# EAGLE design DollyShield (EAGLE 5.10)
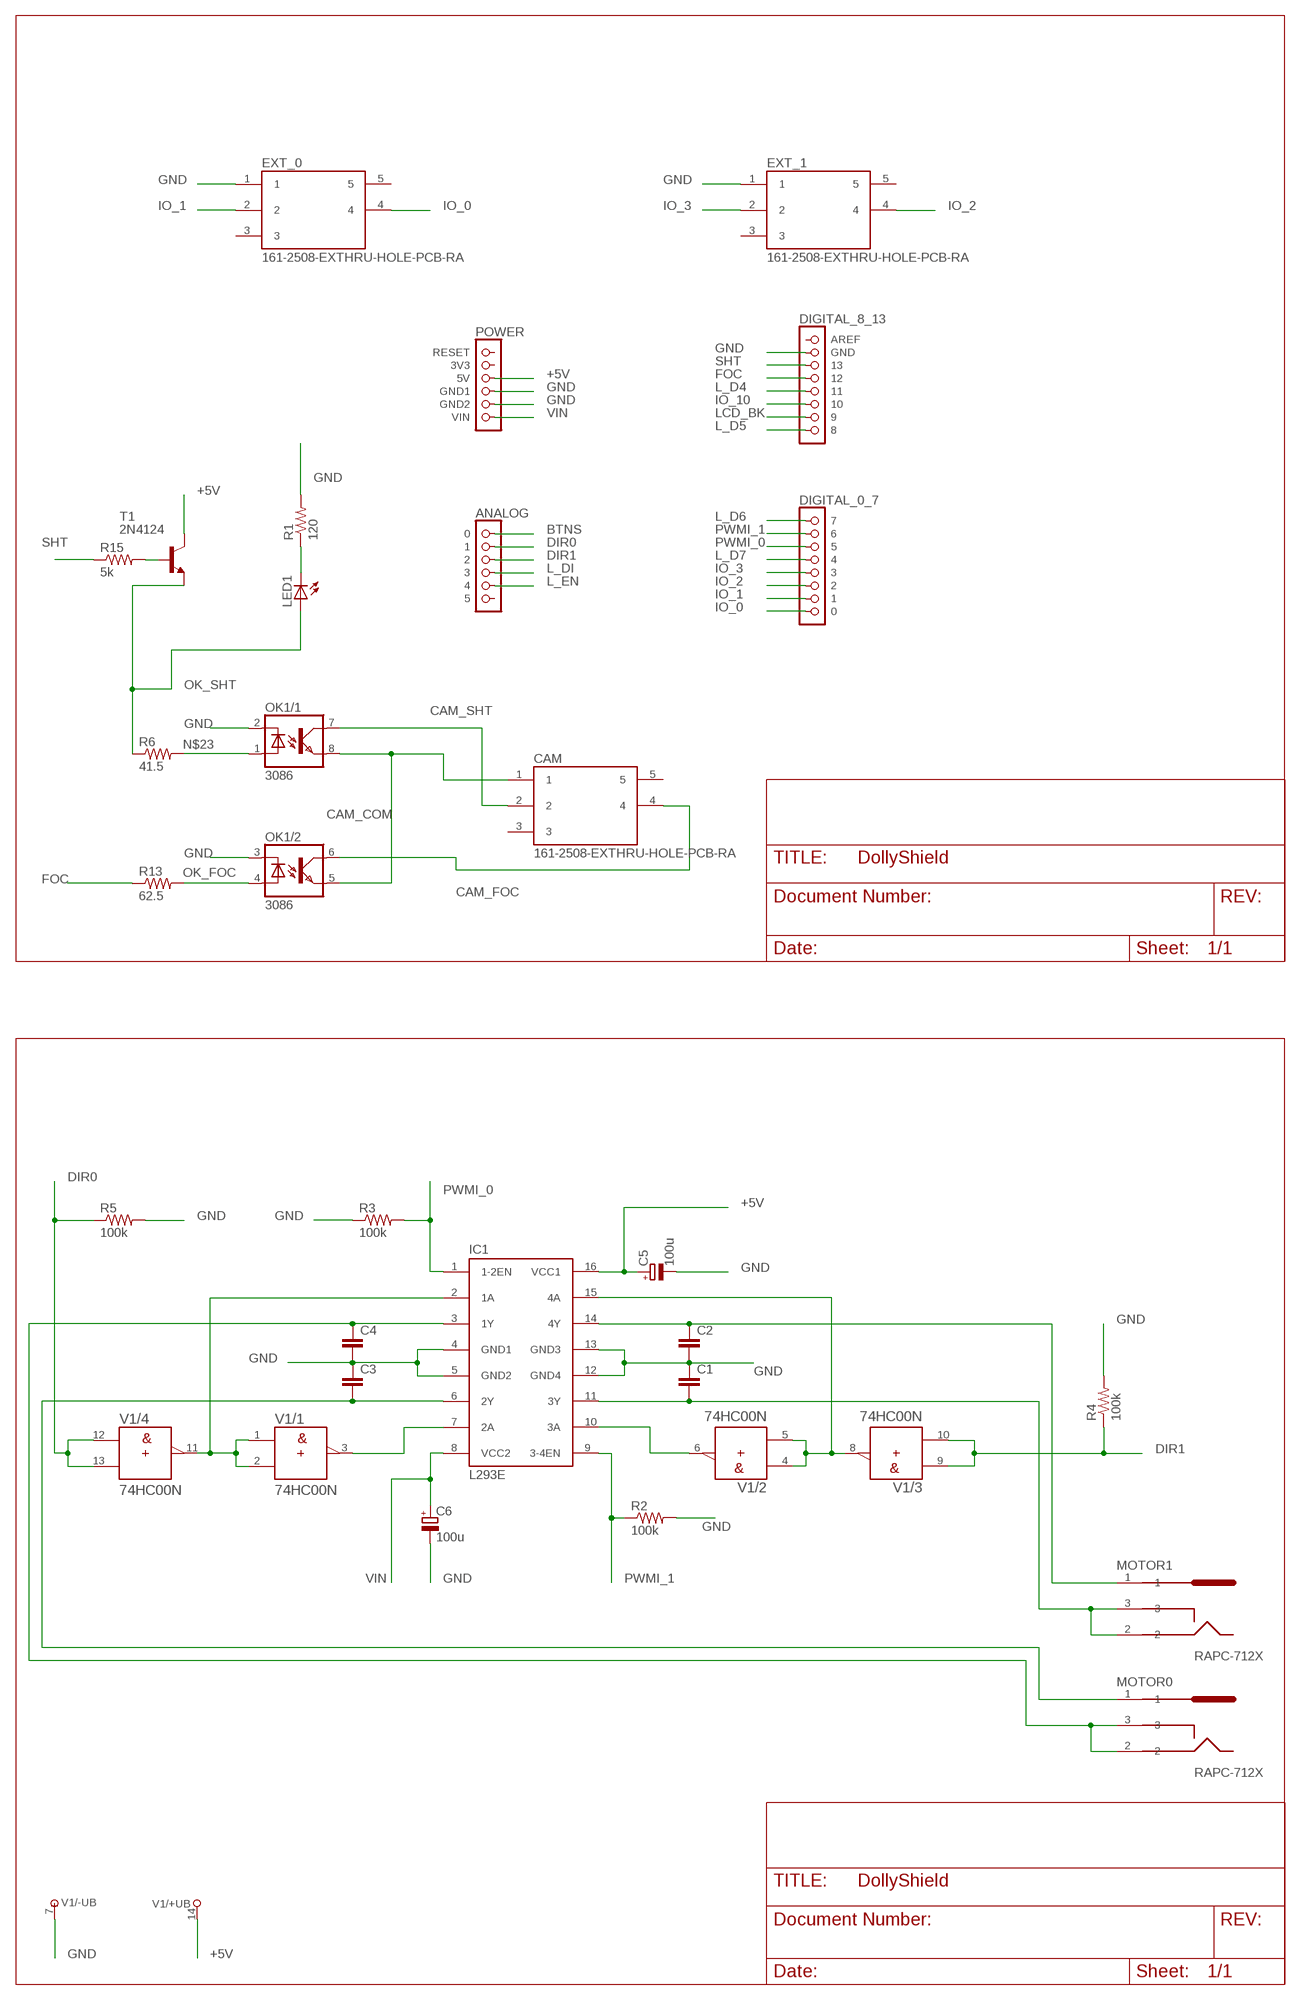
[diagram p0: schematic, sheet 1, part 1 of 2]
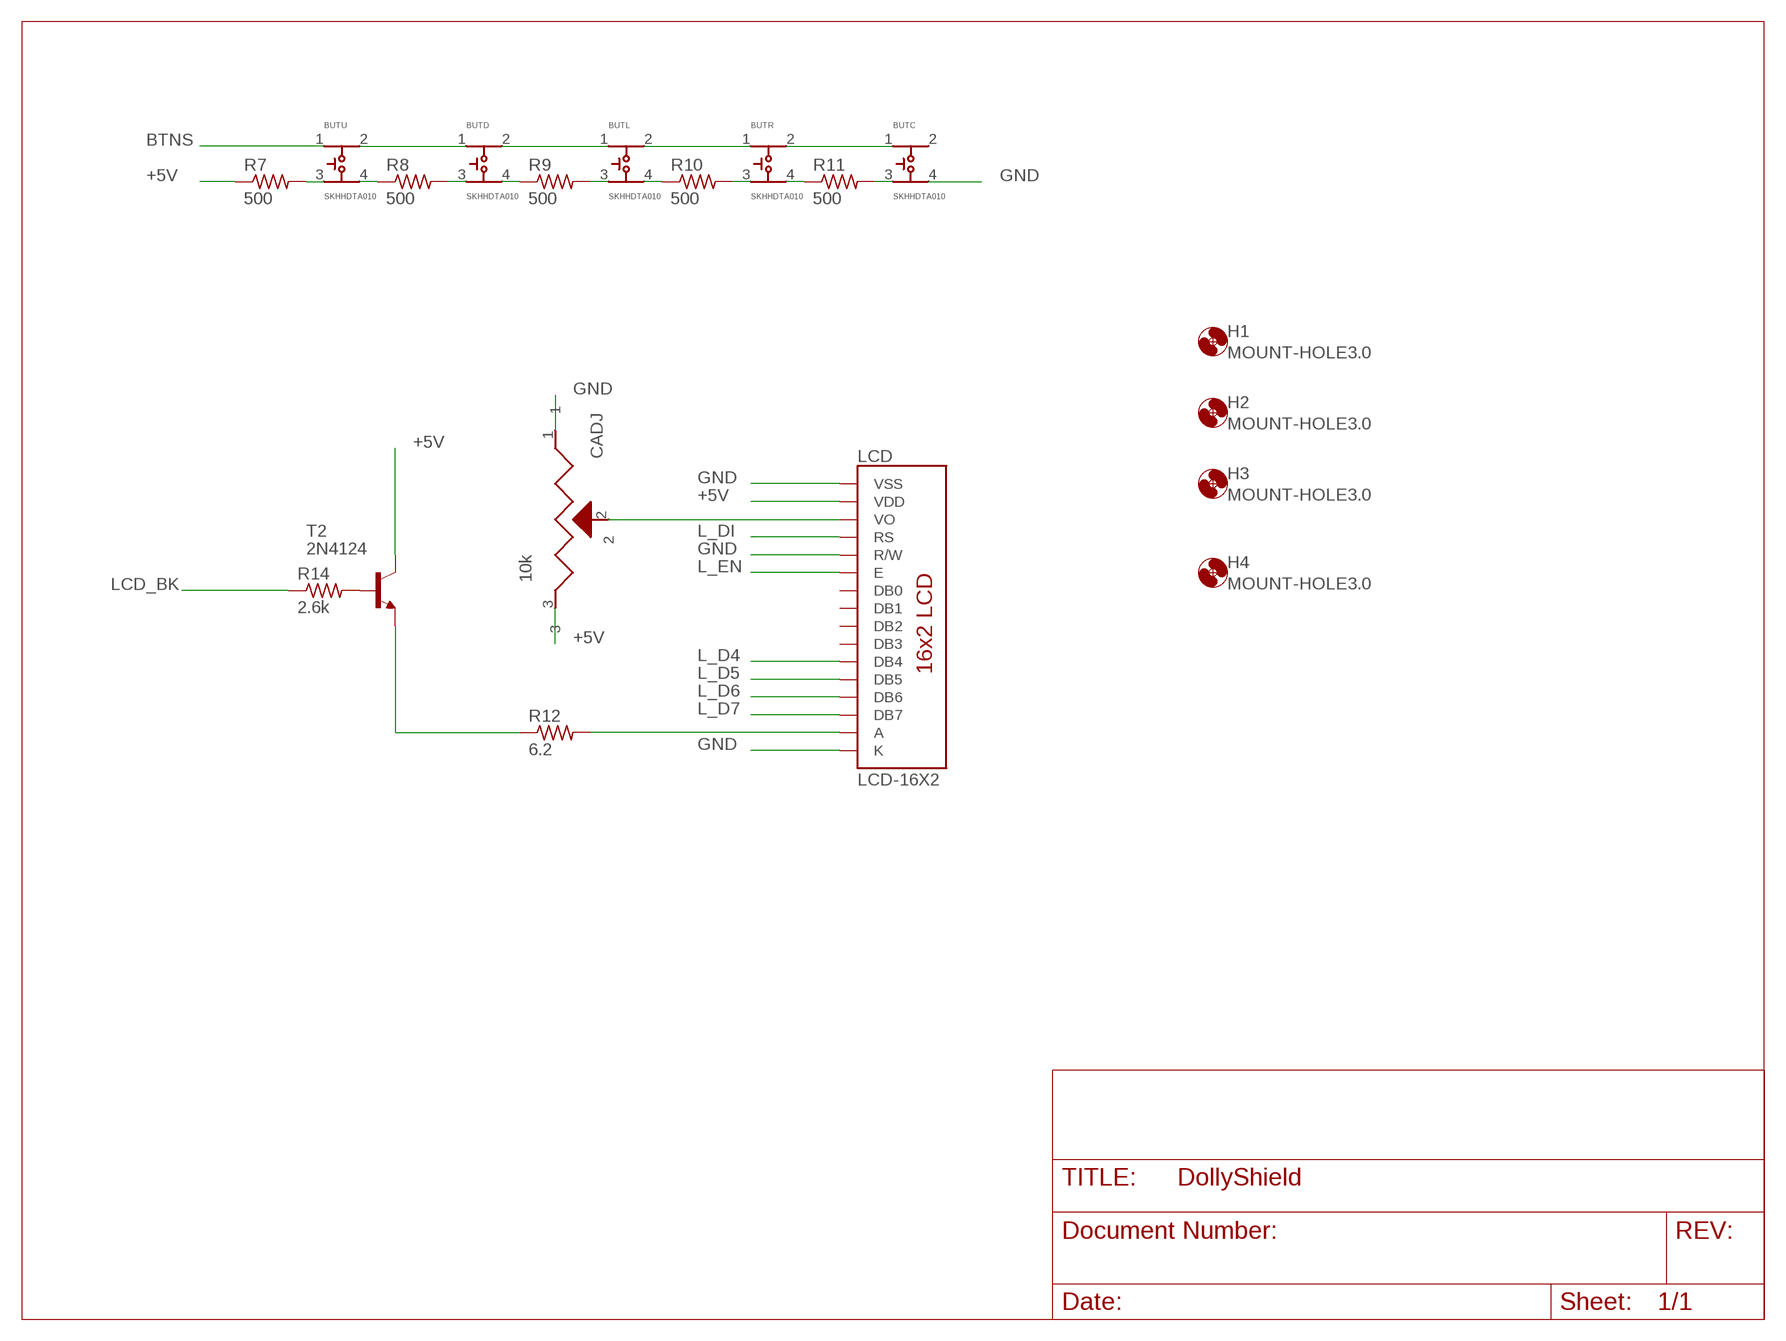
[diagram p1: schematic, sheet 1, part 2 of 2]

## Parts
BUTC  SKHHDTA010  SKHH  [SKHH]
BUTD  SKHHDTA010  SKHH  [SKHH]
BUTL  SKHHDTA010  SKHH  [SKHH]
BUTR  SKHHDTA010  SKHH  [SKHH]
BUTU  SKHHDTA010  SKHH  [SKHH]
C1  C5/3  [C5B3]
C2  C5/3  [C5B3]
C3  C5/3  [C5B3]
C4  C5/3  [C5B3]
C5  100u  CPOL-EUE2-5  [E2-5]
C6  100u  CPOL-EUE2-5  [E2-5]
CADJ  10k  3362U  [3362W]
CAM  161-2508-EXTHRU-HOLE-PCB-RA  [PCB-HORIZ]
EXT_0  161-2508-EXTHRU-HOLE-PCB-RA  [PCB-HORIZ]
EXT_1  161-2508-EXTHRU-HOLE-PCB-RA  [PCB-HORIZ]
H1  MOUNT-HOLE3.0  [3,0]
H2  MOUNT-HOLE3.0  [3,0]
H3  MOUNT-HOLE3.0  [3,0]
H4  MOUNT-HOLE3.0  [3,0]
IC1  L293E  [DIL16]
LCD  LCD-16X2  [LCD-16X2]
LED1  LED3MM  [LED3MM]
MOTOR0  RAPC-712X  [RAPC712X]
MOTOR1  RAPC-712X  [RAPC712X]
OK1  3086  [DIL08]
R1  120  R-US_0207/7  [0207/7]
R2  100k  R-US_0207/7  [0207/7]
R3  100k  R-US_0207/7  [0207/7]
R4  100k  R-US_0207/7  [0207/7]
R5  100k  R-US_0207/7  [0207/7]
R6  41.5  R-US_0207/7  [0207/7]
R7  500  R-US_0207/7  [0207/7]
R8  500  R-US_0207/7  [0207/7]
R9  500  R-US_0207/7  [0207/7]
R10  500  R-US_0207/7  [0207/7]
R11  500  R-US_0207/7  [0207/7]
R12  6.2  R-US_0207/7  [0207/7]
R13  62.5  R-US_0207/7  [0207/7]
R14  2.6k  R-US_0207/7  [0207/7]
R15  5k  R-US_0207/7  [0207/7]
T1  2N4124  -NPN-TO92-EBC  [TO92-EBC]
T2  2N4124  -NPN-TO92-EBC  [TO92-EBC]
U$1  POWER  [1X06]
U$2  ANALOG  [1X06]
U$3  DIGITAL_0_7  [1X08]
U$4  DIGITAL_8_13  [1X08]
V1  74HC00N  [DIL14]

## Nets
+5V: C5.+ CADJ.3 IC1.16(VCC1) LCD.2(VDD) R7.1 T1.C T2.C U$1.3(5V) V1.14(/+UB:+UB)
BTNS: BUTU.1 U$2.1
CAM_COM: CAM.1 OK1.5(/2:EMI) OK1.8(/1:EMI)
CAM_FOC: CAM.4 OK1.6(/2:COL)
CAM_SHT: CAM.2 OK1.7(/1:COL)
DIR0: R5.1 U$2.2 V1.12(/4:A) V1.13(/4:B)
DIR1: R4.1 U$2.3 V1.9(/3:A) V1.10(/3:B)
FOC: R13.1 U$4.4
GND: BUTC.4 C1.1 C2.2 C3.1 C4.2 C5.- C6.- CADJ.1 EXT_0.1 EXT_1.1 IC1.4(GND1) IC1.5(GND2) IC1.12(GND4) IC1.13(GND3) LCD.1(VSS) LCD.5(R/W) LCD.16(K) OK1.2(/1:C) OK1.3(/2:C) R1.2 R2.2 R3.1 R4.2 R5.2 U$1.4(GND1) U$1.5(GND2) U$4.2(GND) V1.7(/-UB:-UB)
IO_0: EXT_0.4 U$3.8
IO_1: EXT_0.2 U$3.7
IO_2: EXT_1.4 U$3.6
IO_3: EXT_1.2 U$3.5
IO_10: U$4.6
L_D4: LCD.11(DB4) U$4.5
L_D5: LCD.12(DB5) U$4.8
L_D6: LCD.13(DB6) U$3.1
L_D7: LCD.14(DB7) U$3.4
L_DI: LCD.4(RS) U$2.4
L_EN: LCD.6(E) U$2.5
LCD_BK: R14.1 U$4.7
LCDA: LCD.15(A) R12.2
M0_A: C3.2 IC1.6(2Y) MOTOR0.1
M0_B: C4.1 IC1.3(1Y) MOTOR0.2 MOTOR0.3
M1_A: C2.1 IC1.14(4Y) MOTOR1.1
M1_B: C1.2 IC1.11(3Y) MOTOR1.2 MOTOR1.3
N$1: LED1.K(C) R1.1
N$2: IC1.7(2A) V1.3(/1:Y)
N$3: IC1.2(1A) V1.1(/1:A) V1.2(/1:B) V1.11(/4:Y)
N$4: IC1.10(3A) V1.6(/2:Y)
N$5: IC1.15(4A) V1.4(/2:A) V1.5(/2:B) V1.8(/3:Y)
N$8: BUTU.3 R7.2
N$9: BUTU.4 R8.1
N$10: BUTD.3 R8.2
N$11: BUTD.4 R9.1
N$12: BUTL.3 R9.2
N$13: BUTL.4 R10.1
N$14: BUTR.3 R10.2
N$15: BUTR.4 R11.1
N$16: BUTC.3 R11.2
N$17: BUTD.1 BUTU.2
N$18: BUTD.2 BUTL.1
N$19: BUTL.2 BUTR.1
N$20: BUTC.1 BUTR.2
N$21: CADJ.2 LCD.3(VO)
N$23: OK1.1(/1:A) R6.2
N$24: R12.1 T2.E
N$25: R15.2 T1.B
N$26: R14.2 T2.B
OK_FOC: OK1.4(/2:A) R13.2
OK_SHT: LED1.A R6.1 T1.E
PWMI_0: IC1.1(1-2EN) R3.2 U$3.3
PWMI_1: IC1.9(3-4EN) R2.1 U$3.2
SHT: R15.1 U$4.3
VIN: C6.+ IC1.8(VCC2) U$1.6(VIN)
Unconnected: BUTC.2 CAM.3 CAM.5 EXT_0.3 EXT_0.5 EXT_1.3 EXT_1.5 LCD.7(DB0) LCD.8(DB1) LCD.9(DB2) LCD.10(DB3) U$1.1(RESET) U$1.2(3V3) U$2.6 U$4.1(AREF)

## Library data of the parts
BUTC BUTD BUTL BUTR BUTU = alps:SKHH: SKHH* vertical/joint stem momentary pushbutton PCB mount switch
C1-C4 = capacitor-wima:C: CAPACITOR naming: grid - package width
C5 C6 = rcl:CPOL-EU: POLARIZED CAPACITOR, European symbol
CADJ = bourns:3362U: Bourns 3362U trim pot top-adjust.
CAM EXT_0 EXT_1 = kobiconn-161-2508-ex:161-2508-EX
H1-H4 = holes:MOUNT-HOLE: MOUNTING HOLE with drill center marker
IC1 = texas:L293E: TI DEVICE
LCD = SparkFun:LCD-16X2
LED1 = SparkFun:LED: LEDs Standard schematic elements and footprints for 5mm, 3mm, 1206, and 0603 sized LEDs. 5mm - Spark Fun Electronics SKU : COM-00529 (and others)
MOTOR0 MOTOR1 = switchcraft:RAPC-712X
OK1 = cchurch-optocoupler:3086: NTE3086 Dual Opto-Coupler DIL8
R1-R15 = resistor:R-US_: RESISTOR, American symbol
T1 T2 = transistor-neu-to92:*-NPN-: NPN Transistror
U$1 = arduino:POWER
U$2 = arduino:ANALOG
U$3 = arduino:DIGITAL_0_7
U$4 = arduino:DIGITAL_8_13
V1 = 74ttl-din:74*00: Quad 2-input NAND gate

## Board
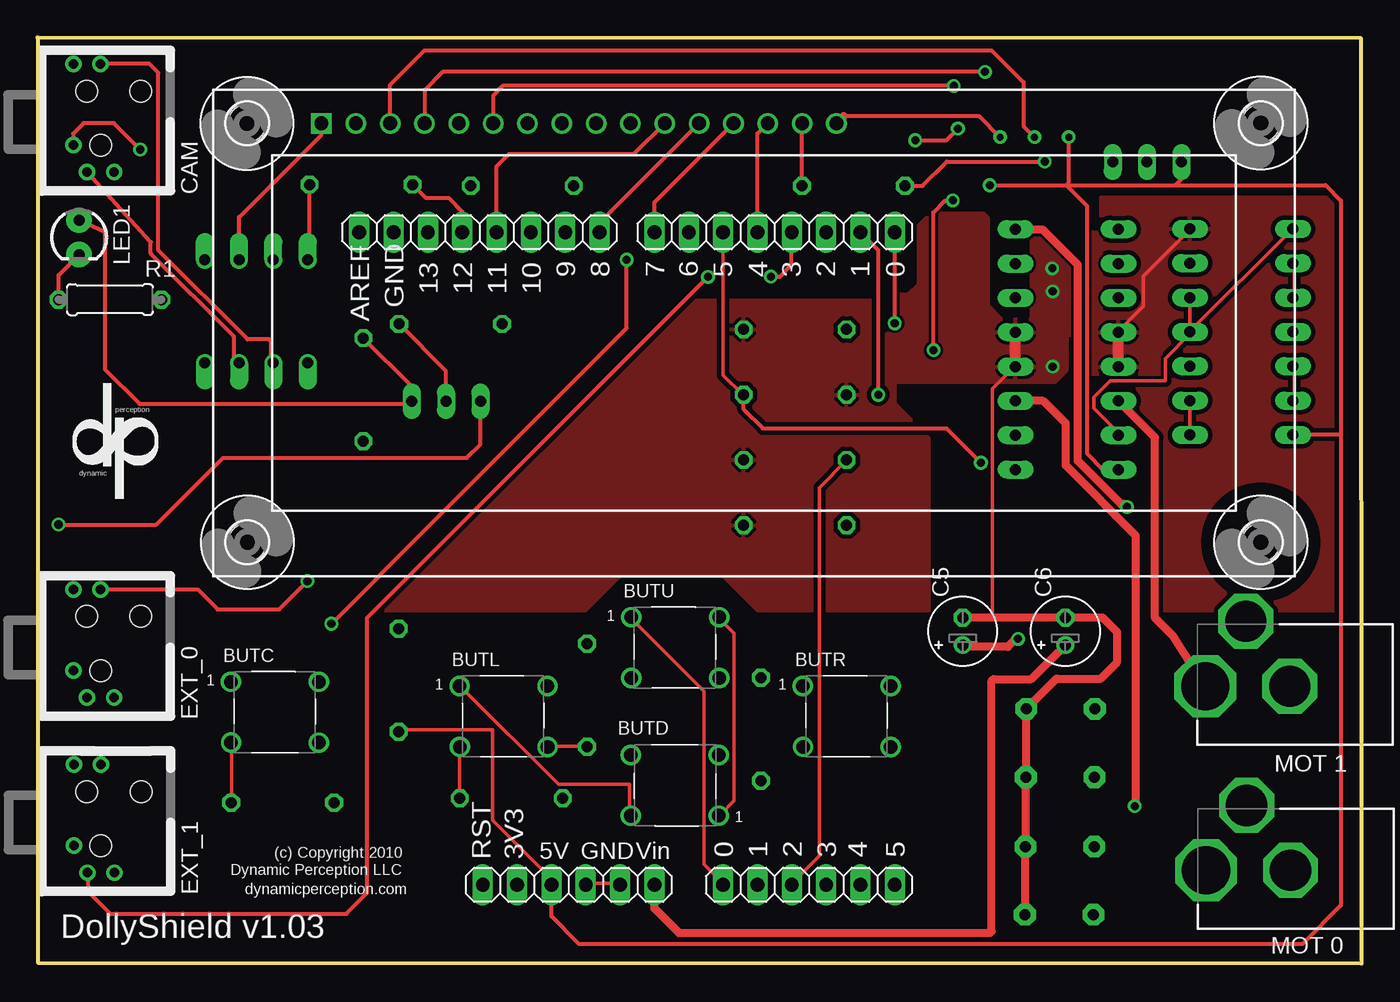
[diagram p2: board, top side]
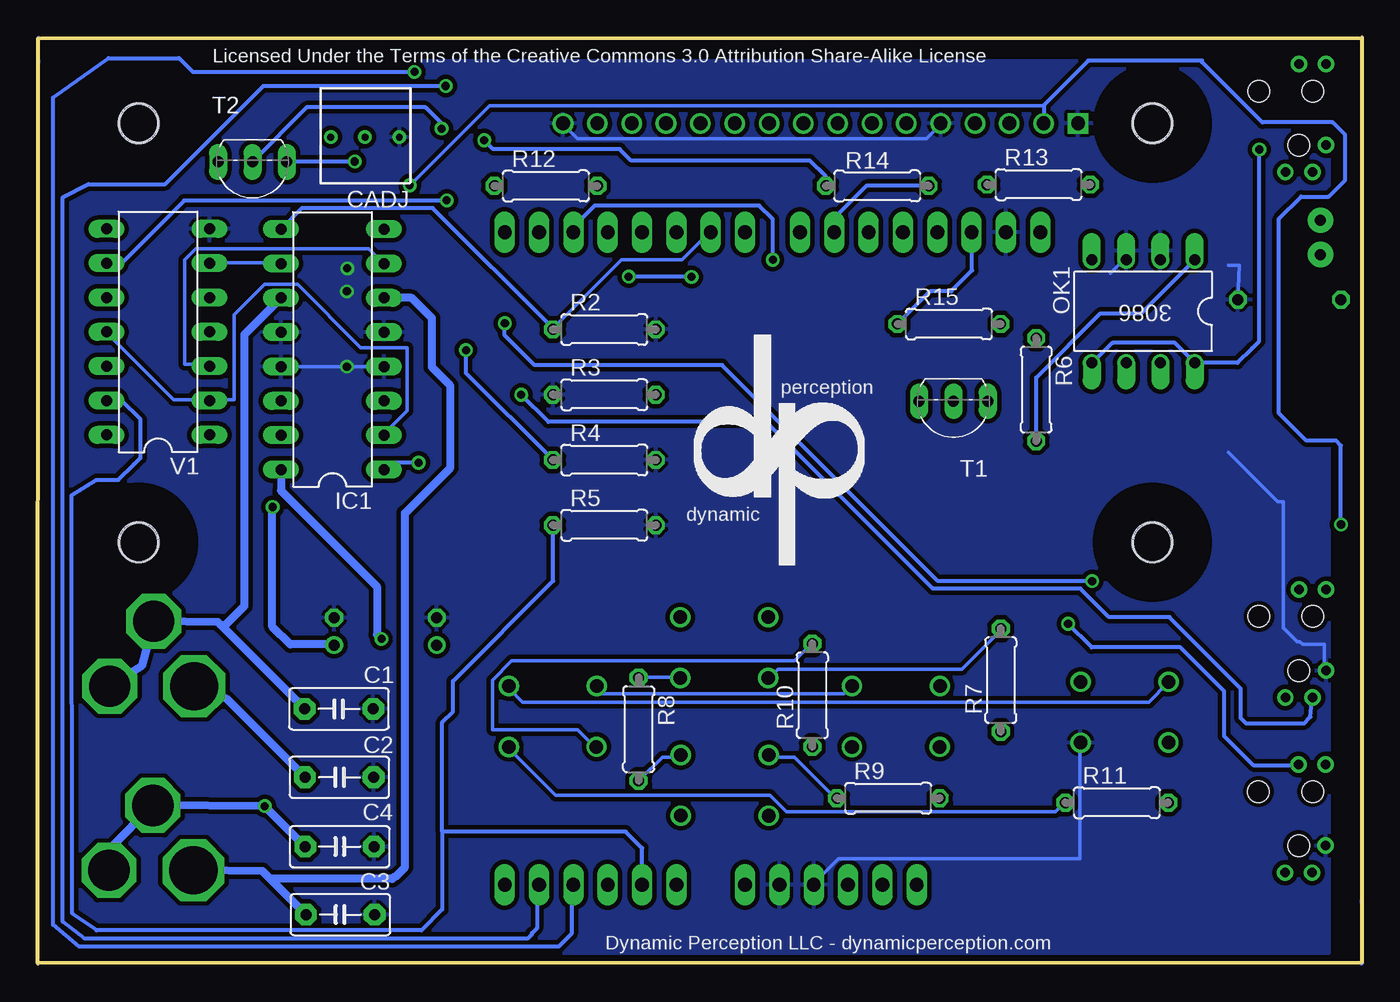
[diagram p3: board, bottom side, seen from below]

Size 98.04 x 68.48 mm. Coordinates in mm from the lower left corner, seen from the top.
Outline: 0,3.28 0,56.62
Outline: 0.08,68.48 0.1,0.05 98.04,0 98.02,68.43 0.08,68.48
Copper layers (1*16): Top 0.035mm / dielectric 1.5mm / Bottom 0.035mm
Design rules "default *": minimum track width 10mil, minimum drill 24mil, track to track 8mil, track to pad 8mil, pad to pad 8mil, via to via 8mil, smd to smd 8mil, copper to edge 8mil, drill to drill 8mil, minimum pad ring 10mil, minimum via ring 8mil, stop-mask expansion 4mil, vias tented up to drill 0mil, thermal gap 10mil

### Footprints (pad centres in the part's own frame; a part is rotated, then mirrored left to right if it is on the bottom)
SKHH = drill 1 round: 1 -3.242,2.261; 2 3.264,2.262; 3 -3.23,-2.242; 4 3.267,-2.245
C5B3 = drill 0.813 pad 1.6 octagon: 1 -2.54,0; 2 2.54,0
E2-5 = drill 0.813 pad 1.27 round: + -1.016,0 | drill 0.813 pad 1.27 octagon: - 1.016,0
3362W = drill 0.5 round: 1 -2.565,0.076; 2 -0.025,0.076; 3 2.515,0.076
PCB-HORIZ = drill 0.7 round: 1 -1.96,-0.32; 2 -3.96,-1.32; 3 -3.96,-3.33; 4 4.04,-2.32; 5 4.04,-0.32 | hole 1.6: 2.04,-1.29; 2.04,-5.29; -1.96,-2.32
3,0 = hole 3: 0,0
DIL16 = drill 0.813 long: 1 -8.89,-3.81; 2 -6.35,-3.81; 3 -3.81,-3.81; 4 -1.27,-3.81; 5 1.27,-3.81; 6 3.81,-3.81; 7 6.35,-3.81; 8 8.89,-3.81; 9 8.89,3.81; 10 6.35,3.81; 11 3.81,3.81; 12 1.27,3.81; 13 -1.27,3.81; 14 -3.81,3.81; 15 -6.35,3.81; 16 -8.89,3.81
LCD-16X2 = drill 1.016 square: 1 -32,15.5 | drill 1.016 round: 2 -29.46,15.5; 3 -26.92,15.5; 4 -24.38,15.5; 5 -21.84,15.5; 6 -19.3,15.5; 7 -16.76,15.5; 8 -14.22,15.5; 9 -11.68,15.5; 10 -9.14,15.5; 11 -6.6,15.5; 12 -4.06,15.5; 13 -1.52,15.5; 14 1.02,15.5; 15 3.56,15.5; 16 6.1,15.5 | hole 2.8: -37.5,15.5; -37.5,-15.5; 37.5,15.5; 37.5,-15.5
LED3MM = drill 0.813 pad 1.88 round: A -1.27,0; K 1.27,0
RAPC712X = drill 3.556 octagon: 1 0,-6.248 | drill 3.048 octagon: 2 0,0; 3 -4.801,-3.251
DIL08 = drill 0.813 offset: 1 -3.81,-3.81; 2 -1.27,-3.81; 3 1.27,-3.81; 4 3.81,-3.81; 5 3.81,3.81; 6 1.27,3.81; 7 -1.27,3.81; 8 -3.81,3.81
0207/7 = drill 0.813 octagon: 1 -3.81,0; 2 3.81,0
TO92-EBC = drill 0.813 long: B 0,-1.27; C 2.54,-1.27; E -2.54,-1.27
1X06 = drill 1.016 long: 1 -6.35,0; 2 -3.81,0; 3 -1.27,0; 4 1.27,0; 5 3.81,0; 6 6.35,0
1X08 = drill 1.016 long: 1 -8.89,0; 2 -6.35,0; 3 -3.81,0; 4 -1.27,0; 5 1.27,0; 6 3.81,0; 7 6.35,0; 8 8.89,0
DIL14 = drill 0.813 long: 1 -7.62,-3.81; 2 -5.08,-3.81; 3 -2.54,-3.81; 4 0,-3.81; 5 2.54,-3.81; 6 5.08,-3.81; 7 7.62,-3.81; 8 7.62,3.81; 9 5.08,3.81; 10 2.54,3.81; 11 0,3.81; 12 -2.54,3.81; 13 -5.08,3.81; 14 -7.62,3.81

### Placement (x,y rotation side)
BUTC  17.63,18.57 0 top
BUTD  47.24,13.18 180 top
BUTL  34.54,18.26 0 top
BUTR  59.94,18.26 0 top
BUTU  47.24,23.34 0 top
C1  75.77,18.82 180 bottom
C2  75.74,13.77 0 bottom
C3  75.67,3.61 180 bottom
C4  75.72,8.64 0 bottom
C5  68.53,24.56 90 top
C6  76.12,24.56 90 top
CADJ  73.86,61.19 180 bottom
CAM  2.41,62.48 90 top
EXT_0  2.41,23.62 90 top
EXT_1  2.44,10.67 90 top
H1  15.57,62.13 0 top
H2  90.58,62.15 0 top
H3  15.6,31.14 0 top
H4  90.58,31.14 0 top
IC1  76.25,45.42 90 bottom
LCD  53.09,46.63 0 top
LED1  3.15,53.7 270 top
MOTOR0  92.79,6.88 270 top
MOTOR1  92.74,20.5 270 top
OK1  16.26,48.23 180 bottom
R1  5.44,49.1 0 top
R2  56.13,46.89 0 bottom
R3  56.13,42.06 0 bottom
R4  56.13,37.24 0 bottom
R5  56.13,32.41 0 bottom
R6  24.18,42.44 270 bottom
R7  26.8,20.95 90 bottom
R8  53.59,17.32 270 bottom
R9  35.13,12.22 0 bottom
R10  40.74,19.84 90 bottom
R11  18.21,11.89 0 bottom
R12  60.45,57.51 0 bottom
R13  24,57.61 0 bottom
R14  35.94,57.51 180 bottom
R15  30.63,47.29 0 bottom
T1  30.3,40.31 180 bottom
T2  82.17,58.01 180 bottom
U$1  39.37,5.82 0 top
U$2  57.15,5.82 0 top
U$3  54.61,54.08 0 top
U$4  32.77,54.08 0 top
V1  89.15,46.71 90 bottom

### Tracks (layer width: path | path; a pad name or v marks a point on that pad's centre or on a via)
+5V  (via drill 0.6)
  Top 0.254: R7.1 26.82,17.3 33.73,17.3 33.73,10.59 38,6.32 38,5.92 U$1.3
  Top 0.305: 84.25,57.56 95.38,57.56 96.52,56.41 96.52,39.09 | 76.2,57.56 84.25,57.56 | v70.54,57.56 76.2,57.56 | U$1.3 38.1,3.48 40.16,1.42 93.65,1.42 96.52,4.29 96.52,39.09 | CADJ.3 76.38,57.73 76.2,57.56 | T2.C 84.71,58.01 84.25,57.56 | 96.52,39.09 V1.14 | IC1.16 78.92,36.53 77.72,37.72 77.72,56.03 76.2,57.56 | T1.C 32.84,38.4 31.83,37.39 13.79,37.39 8.87,32.46 v1.63,32.46
  Top 0.61: C5.+ 68.66,23.42 71.88,23.42 72.47,24 v72.62,24
  Bottom 0.254: 70.31,57.73 64.62,63.42 23.77,63.42 23.63,63.47
  Bottom 0.305: LCD.2 23.63,63.47 20.32,66.78 11.89,66.78 11.89,66.65 7.44,62.2 2.23,62.2 1.32,61.29 1.32,57.94 2.54,56.72 4.57,56.72 6.22,55.07 6.22,40.69 4.19,38.66 1.98,38.66 1.63,38.3 v1.63,32.46 | v70.54,57.56 70.48,57.56 70.31,57.73
  Bottom 0.61: v72.62,24 72.95,24.33 72.95,27.86 80.06,34.98 IC1.16
BTNS
  Top 0.254: BUTU.1 44.09,25.43 49.38,20.14 49.38,7.34 50.8,5.92 U$2.1
CAM_COM  (via drill 0.6)
  Top 0.305: CAM.1 2.71,61.38 3.48,62.15 5.71,62.15 v7.67,60.2
  Bottom 0.305: OK1.5 20.02,44.42 18.54,45.9 13.92,45.9 OK1.8 9.3,44.42 8.2,45.52 8.18,45.52 7.67,46.02 v7.67,60.2
CAM_FOC
  Top 0.305: OK1.6 17.35,44.6 17.35,46 17.2,46.15 15.62,46.15 9.02,52.76 9.02,65.86 8.33,66.55 4.76,66.55 CAM.4
CAM_SHT
  Top 0.305: OK1.7 14.61,44.81 14.61,46.38 14.58,46.38 8.46,52.5 8.46,53.34 CAM.2
DIR0
  Top 0.254: V1.13 93.07,41.68 93.07,44.12 V1.12
  Bottom 0.305: V1.13 91.85,41.63 90.45,40.23 90.45,37.39 90.91,36.93 90.93,36.93 92.1,35.76 93.7,35.76 95.56,34.62 95.5,3.68 93.7,2.44 69.67,2.44 68.12,3.99 68.12,9.75 | 68.12,9.75 68.12,17.83 67.33,18.62 67.33,20.88 59.92,28.3 59.92,32.38 R5.1 | U$2.2 53.34,8.53 54.56,9.75 68.12,9.75
DIR1  (via drill 0.6)
  Top 0.254: V1.10 93.07,49.4 93.07,51.64 V1.9 | R4.1 59.94,37.21 57.91,35.18 57.91,7.95 55.88,5.92 U$2.3
  Top 0.305: v66.37,45.36 66.34,45.39 66.34,55.52 67.26,56.44 v67.79,56.44
  Bottom 0.305: R4.1 66.37,43.66 v66.37,45.36 | v67.79,56.44 67.82,56.41 87.22,56.41 91.85,51.79 V1.9
FOC
  Top 0.305: U$4.4 31.5,55.6 30.48,56.62 28.8,56.62 R13.1
GND  (via drill 0.6)
  Top 0.254: U$1.5 43.08,5.92 40.64,5.92 U$1.4 | 72.54,44.32 IC1.4 72.34,44.12 70.71,42.49 70.71,25.58 | 72.54,46.56 IC1.5 72.34,46.76 | V1.7 85.34,54.28 81.89,50.83 81.89,48.59 80.06,46.76 IC1.12
  Top 0.305: OK1.2 14.99,55.19 21.09,61.29 LCD.1 | 59.74,62.69 69.72,62.69 CADJ.1
  Top 0.61: C3.1 73.18,3.66 C4.2 73.2,8.66 C2.2 73.23,13.79 C1.1 75.46,21.06 78.74,21.06 79.96,22.28 79.96,24.51 78.89,25.58 C6.- 70.71,25.58 C5.- | LCD.16 59.74,62.69
  Top 0.813: 72.54,44.32 72.44,44.42 IC1.5 | IC1.13 IC1.12
  Bottom 0.254: BUTC.4 20.93,16.28 20.93,7.75 38.81,7.75 40.64,5.92 U$1.4 | IC1.4 72.54,44.12 80.06,44.12 IC1.13 | LCD.5 31.29,62 32.31,60.99 58.12,60.99 59.13,62 LCD.16 | 9.96,37.82 6.3,34.16 5.89,34.16 5.89,24.82 4.88,23.8 4.67,23.8 4.47,23.6 2.85,23.6 2.85,21.77 EXT_0.1 | 9.96,51.64 9.14,51.64 R1.2 | 18.69,51.03 17.68,52.04 OK1.3
  other vias: 75.16,51.41 75.18,49.71 75.18,44.15
  pour Top: 78.13,47.88 83.16,47.88 83.16,43.59 78.13,43.59
  pour Top: 76.2,49 76.2,43.92 76.2,43.84 75.36,43 63.73,43 63.07,43.66 63.07,49.4 63.14,49.48 64.52,49.48 65.28,50.24 65.28,54.58 66.19,55.5 70.05,55.5 70.38,55.17 70.38,48.67 71.4,47.65 74.85,47.65
  pour Bottom (isolate 0.33): 2.54,66.78 2.54,0.74 96.52,0.74 96.52,66.78
  pour Top (isolate 0.33): 63.5,49 27.94,49 22.86,43.92 22.86,26.14 40.64,26.14 43.18,28.68 50.8,28.68 53.34,26.14 66.04,26.14 66.04,38.84 63.5,41.38
  pour Top (isolate 0.33): 78.74,56.62 78.74,26.14 96.52,26.14 96.52,56.62
  pour Top: 73.66,46.46 73.66,54.08 78.74,54.08 78.74,46.46
IO_0  (via drill 0.6)
  Top 0.305: EXT_0.4 11.91,27.66 13.39,26.19 17.96,26.19 v20.04,28.27 | v63.5,47.35 U$3.8
  Bottom 0.305: v20.04,28.27 31.45,28.27 47.42,44.25 61.29,44.25 63.5,46.46 v63.5,47.35
IO_1  (via drill 0.6)
  Top 0.305: v62.28,42.06 62.28,52.76 U$3.7
  Bottom 0.305: EXT_0.2 3.88,18.24 4.39,17.73 8.64,17.73 9.04,18.14 9.04,20.32 14.33,25.6 18.8,25.6 20.9,27.71 31.83,27.71 44.17,40.06 60.27,40.06 v62.28,42.06
IO_2  (via drill 0.6)
  Top 0.305: v21.82,25.12 25.38,28.68 25.38,28.7 43.66,46.99 v43.66,52.04
  Bottom 0.305: v21.82,25.12 20.07,23.37 13.51,23.37 10.26,20.12 10.26,16.81 8.08,14.63 4.99,14.63 EXT_1.4 | v43.66,52.04 43.66,55.04 44.68,56.06 56.84,56.06 58.45,54.46 58.45,54.1 U$3.6
IO_3  (via drill 0.6)
  Top 0.305: EXT_1.2 3.91,5.21 5.46,3.66 22.91,3.66 24.46,5.21 24.46,25.55 v49.68,50.77 | v54.33,50.8 54.99,50.8 55.85,51.66 55.85,54.05 U$3.5
  Bottom 0.305: v49.68,50.77 54.3,50.77 v54.33,50.8
L_D4
  Top 0.305: U$4.5 34.04,58.95 34.95,59.87 44.22,59.87 LCD.11
L_D5
  Top 0.305: LCD.12 41.66,54.76 U$4.8
L_D6
  Top 0.305: LCD.13 45.72,56.29 U$3.1
L_D7
  Top 0.305: LCD.14 53.34,61.37 U$3.4
L_DI  (via drill 0.6)
  Top 0.305: LCD.4 28.71,64.6 30.05,65.94 v70.18,65.94
  Bottom 0.305: U$2.4 58.57,5.66 58.57,2.18 59.51,1.24 95,1.24 96.93,2.84 96.93,64.06 92.84,66.95 87.61,66.95 86.59,65.94 v70.18,65.94
L_EN  (via drill 0.6)
  Top 0.305: LCD.6 33.79,64.21 33.78,64.21 33.81,64.21 34.49,64.9 v67.87,64.9
  Bottom 0.305: U$2.5 61.11,5.66 61.11,2.62 61.49,2.24 61.49,2.16 61.82,1.83 94.59,1.83 96.19,3.07 96.19,56.67 94.31,57.63 88.62,57.63 81.36,64.9 v67.87,64.9
LCD_BK
  Bottom 0.305: U$4.7 39.12,55.14 36.75,57.51 R14.1
LCDA
  Top 0.305: R12.2 LCD.15
M0_A
  Bottom 0.61: 80.85,6.25 C3.2 | MOTOR0.1 81.43,6.83 80.85,6.25 | 80.85,6.25 71.83,6.25 71.7,6.38 71.63,6.38 70.89,7.11 70.89,33.3 67.51,36.68 67.51,42.72 68.89,44.09 68.89,47.73 70.38,49.23 IC1.6
M0_B  (via drill 0.6)
  Top 0.61: v81.25,11.63 81.33,11.71 81.33,31.65 76.15,36.83 76.15,39.95 74.5,41.61 IC1.3
  Bottom 0.61: C4.1 v81.25,11.63 MOTOR0.3 92.79,8.43 MOTOR0.2
M1_A
  Top 0.61: IC1.14 82.75,38.91 82.75,25.55 84.12,24.18 MOTOR1.1
  Bottom 0.61: C2.1 84.12,19.61 MOTOR1.1
M1_B
  Bottom 0.61: C1.2 84.53,25.04 | 84.53,25.04 84.73,25.25 MOTOR1.3 90.37,22 MOTOR1.2 | IC1.11 82.75,46.53 82.75,26.44 84.15,25.04 84.53,25.04
N$1
  Top 0.305: R1.1 1.63,50.9 LED1.K
N$2
  Bottom 0.254: IC1.7 72.54,51.84 73.56,52.86 86.36,52.86 87.17,52.04 87.17,44.32 85.34,44.32 V1.3
N$3
  Top 0.254: V1.2 V1.1
  Bottom 0.254: 85.34,41.68 83.52,41.68 83.52,47.98 81.28,50.22 78.84,50.22 74.17,45.54 70.71,45.54 70.71,40.87 72.34,39.24 IC1.2 | 85.34,41.68 87.99,41.68 92.86,46.56 V1.11 | 85.34,41.68 V1.2
N$4
  Bottom 0.254: IC1.10 80.06,51.84 85.34,51.84 V1.6
N$5
  Top 0.254: IC1.15 80.06,39.24 78.23,41.07 78.23,41.88 79.45,43.1 83.52,43.1 83.52,44.73 85.34,46.56 V1.4 85.34,46.76 | 85.34,46.76 V1.5 | 85.34,46.76 92.86,54.28 V1.8
N$6
  Bottom 0.305: 0.1,4.57 0.1,-0.03
N$7
  Bottom 0.305: 98.02,68.45 98.02,66.73 98.04,66.73
N$8
  Bottom 0.254: R7.2 26.82,24.61 29.67,21.77 43.28,21.77 43.89,21.16 BUTU.3
N$9
  Bottom 0.254: R8.1 53.44,21.16 50.6,21.16 BUTU.4
N$10
  Bottom 0.254: R8.2 53.44,13.64 51.82,15.27 50.6,15.27 BUTD.3
N$11
  Bottom 0.254: R9.1 39.01,12.22 42.06,15.27 43.89,15.27 BUTD.4
N$12
  Top 0.254: R9.2 31.29,12.22 31.29,15.87 BUTL.3
N$13
  Top 0.254: R10.1 40.64,16.08 38,16.08 BUTL.4
N$14
  Bottom 0.254: R10.2 40.84,23.6 42.06,22.38 62.99,22.38 64.41,20.95 64.41,17.3 58.12,17.3 56.9,16.08 BUTR.3
N$15
  Bottom 0.254: R11.1 22.15,11.81 22.76,11.2 42.67,11.2 43.89,12.42 59.74,12.42 63.2,15.87 BUTR.4
N$16
  Top 0.254: R11.2 14.43,12.01 14.43,16.28 BUTC.3
N$17
  Top 0.254: BUTD.1 50.6,11 51.61,12.01 51.61,24.41 50.6,25.43 BUTU.2
N$18
  Top 0.254: BUTL.1 31.5,20.35 38.61,13.23 43.89,13.23 43.89,11 BUTD.2
N$19
  Bottom 0.254: BUTR.1 56.69,20.35 56.29,19.94 38.41,19.94 38,20.35 BUTL.2
N$20
  Bottom 0.254: BUTC.1 14.43,20.75 15.85,19.33 62.18,19.33 63.2,20.35 BUTR.2
N$21
  Top 0.305: LCD.3 26.17,65 28.7,67.54 70.66,67.54 73.03,65.18 73.03,61.93 CADJ.2
N$23
  Bottom 0.305: R6.2 24.18,43.33 19.43,48.08 16.41,48.08 OK1.1
N$24  (via drill 0.6)
  Top 0.305: v74.6,59.31 67.36,59.31 65.56,57.51 R12.1
  Bottom 0.305: v74.6,59.31 T2.E
N$25
  Top 0.305: T1.B 30.3,43.81 R15.2
N$26  (via drill 0.6)
  Top 0.305: v65.02,60.88 67.31,60.88 v68.17,61.75
  Bottom 0.305: v65.02,60.88 64.36,60.22 54.99,60.22 54.15,59.39 40.92,59.39 39.75,58.22 R14.2 | v68.17,61.75 68.17,62.13 69.37,63.32 78.16,63.32 T2.B
OK_FOC
  Top 0.305: R13.2 20.19,52.17 OK1.4
OK_SHT
  Top 0.305: R6.1 27.76,42.67 T1.E 27.56,41.38 7.62,41.38 5.08,43.92 5.08,54.08 LED1.A
PWMI_0  (via drill 0.6)
  Top 0.254: U$3.3 50.8,43.51 52.22,42.09 R3.2
  Top 0.305: R3.2 52.32,41 53.75,39.57 67.33,39.57 v69.88,37.03
  Bottom 0.305: v69.88,37.03 71.93,37.03 IC1.1
PWMI_1
  Bottom 0.254: R2.1 59.94,46.96 54.86,52.04 50.39,52.04 48.36,54.08 U$3.2
  Bottom 0.305: 59.94,46.96 68.83,55.85 78.51,55.85 IC1.9
SHT
  Bottom 0.305: U$4.3 28.93,54.05 28.93,51.26 30.48,49.71 32.03,49.71 R15.1
VIN  (via drill 0.61)
  Top 0.61: C6.+ 73.61,21.03 70.81,21.03 70.66,20.88 70.66,2.36 70.56,2.26 47.52,2.26 45.72,4.06 U$1.6 | IC1.8 72.47,54.28 74.45,54.28 77.04,51.69 77.04,37.16 80.21,33.99 80.44,33.99 v80.67,33.76
  Bottom 0.254: C6.+ 76.2,23.6
  Bottom 0.61: 76.2,23.6 79.38,23.6 80.7,24.92 80.7,33.73 v80.67,33.76

### Text on the board
tPlace: perception | dynamic | (c) Copyright 2010 | Dynamic Perception LLC | dynamicperception.com | DollyShield v1.03
bPlace: Licensed Under the Terms of the Creative Commons 3.0 Attribution Share-Alike License | 3086 | perception | dynamic | Dynamic Perception LLC - dynamicperception.com
tNames: 9 | 8 | 7 | 6 | 5 | 4 | 3 | 2 | 1 | 0 | 13 | 12 | 11 | 10 | GND | AREF | MOT 1 | 0 | 1 | 2 | 3 | 4 | 5 | RST | 3V3 | 5V | GND | Vin | MOT 0
TallParts: USB | ISP | PWR
ArduinoHoles: 3.2mm | 2.2mm | 3.2mm